# EAGLE design arduino mega cw keyer (EAGLE 7.6.0)
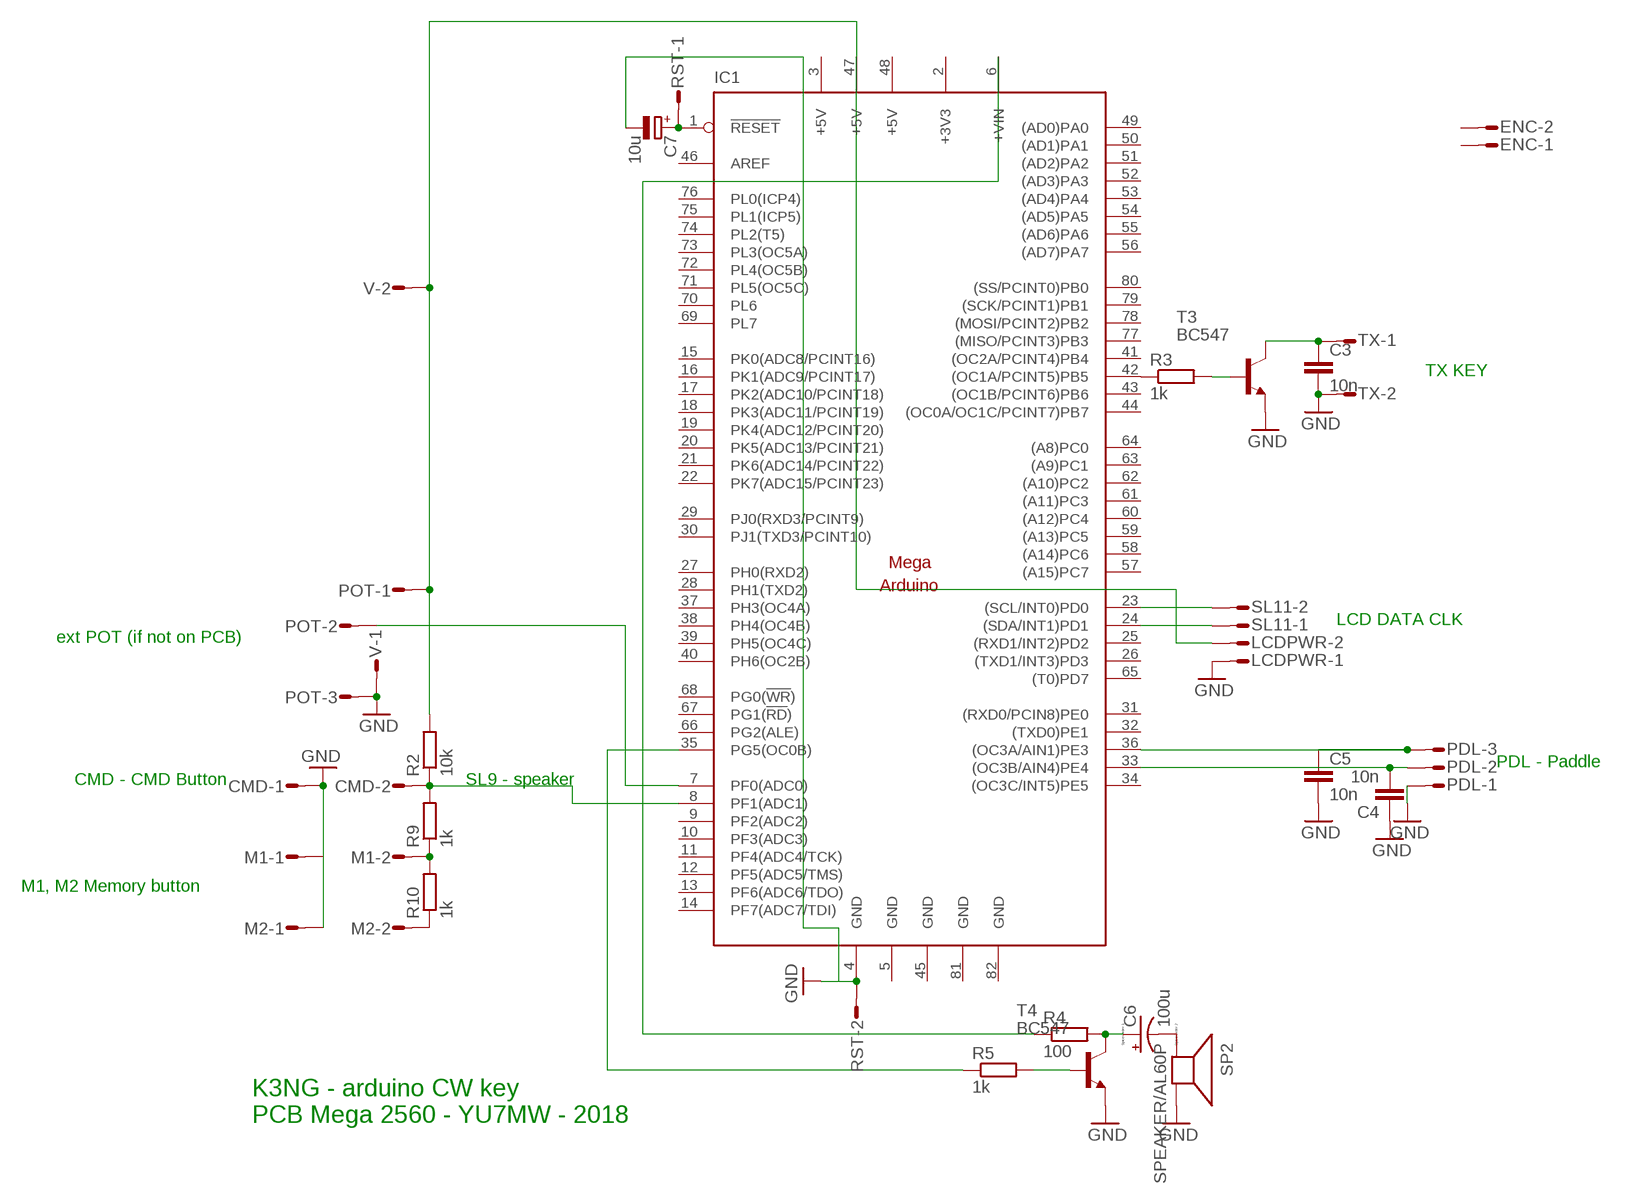
[diagram p0: schematic, sheet 1]

## Parts
C3  10n  C-EU050-025X075  [C050-025X075]
C4  10n  C-EU050-025X075  [C050-025X075]
C5  10n  C-EU050-025X075  [C050-025X075]
C6  100u  CPOL-USE2.5-5  [E2,5-5]
C7  10u  CPOL-EUE2,5-6E  [E2,5-6E]
CMD  M02S  [02P]
ENC  M02S  [02P]
IC1  MEGAARDUINO_1  [MEGA_ARDUINO]
LCDPWR  M02S  [02P]
M1  M02S  [02P]
M2  M02S  [02P]
PDL  M03S  [03P]
POT  M03S  [03P]
R2  10k  R-EU_0207/10  [0207/10]
R3  1k  R-EU_0207/10  [0207/10]
R4  100  R-EU_0207/10  [0207/10]
R5  1k  R-EU_0207/10  [0207/10]
R9  1k  R-EU_0207/10  [0207/10]
R10  1k  R-EU_0207/10  [0207/10]
RST  M02S  [02P]
SL11  M02S  [02P]
SP2  SPEAKER/AL60P  [AL60P]
T3  BC547  [TO92]
T4  BC547  [TO92]
TX  M02S  [02P]
V  M02S  [02P]

## Nets
GND: C3.2 C4.1 C5.2 C7.- CMD.1 IC1.4(GND) LCDPWR.1 M1.1 M2.1 PDL.1 POT.3 RST.2 SP2.2(-) T3.1(E) T4.1(E) TX.2 V.1
N$1: IC1.7(PF0(ADC0)) POT.2
N$4: IC1.23((SCL/INT0)PD0) SL11.2
N$5: IC1.24((SDA/INT1)PD1) SL11.1
N$6: IC1.42((OC1A/PCINT5)PB5) R3.1
N$7: C7.+ IC1.1(!RESET) RST.1
N$8: C5.1 IC1.36((OC3A/AIN1)PE3) PDL.3
N$9: C4.2 IC1.33((OC3B/AIN4)PE4) PDL.2
N$10: R3.2 T3.2(B)
N$11: C3.1 T3.3(C) TX.1
N$12: R5.2 T4.2(B)
N$13: C6.+ R4.2 T4.3(C)
N$15: C6.- SP2.1(+)
N$20: IC1.6(+VIN) R4.1
N$22: IC1.35(PG5(OC0B)) R5.1
N$23: CMD.2 IC1.8(PF1(ADC1)) R2.1 R9.2
N$25: M1.2 R9.1 R10.2
N$27: M2.2 R10.1
N$30: IC1.47(+5V) LCDPWR.2 POT.1 R2.2 V.2
Unconnected: ENC.1 ENC.2 IC1.9(PF2(ADC2)) IC1.10(PF3(ADC3)) IC1.11(PF4(ADC4/TCK)) IC1.12(PF5(ADC5/TMS)) IC1.13(PF6(ADC6/TDO)) IC1.14(PF7(ADC7/TDI)) IC1.15(PK0(ADC8/PCINT16)) IC1.16(PK1(ADC9/PCINT17)) IC1.17(PK2(ADC10/PCINT18)) IC1.18(PK3(ADC11/PCINT19)) IC1.19(PK4(ADC12/PCINT20)) IC1.20(PK5(ADC13/PCINT21)) IC1.21(PK6(ADC14/PCINT22)) IC1.22(PK7(ADC15/PCINT23)) IC1.25((RXD1/INT2)PD2) IC1.26((TXD1/INT3)PD3) IC1.27(PH0(RXD2)) IC1.28(PH1(TXD2)) IC1.29(PJ0(RXD3/PCINT9)) IC1.30(PJ1(TXD3/PCINT10)) IC1.31((RXD0/PCIN8)PE0) IC1.32((TXD0)PE1) IC1.34((OC3C/INT5)PE5) IC1.37(PH3(OC4A)) IC1.38(PH4(OC4B)) IC1.39(PH5(OC4C)) IC1.40(PH6(OC2B)) IC1.41((OC2A/PCINT4)PB4) IC1.43((OC1B/PCINT6)PB6) IC1.44((OC0A/OC1C/PCINT7)PB7) IC1.46(AREF) IC1.49((AD0)PA0) IC1.50((AD1)PA1) IC1.51((AD2)PA2) IC1.52((AD3)PA3) IC1.53((AD4)PA4) IC1.54((AD5)PA5) IC1.55((AD6)PA6) IC1.56((AD7)PA7) IC1.57((A15)PC7) IC1.58((A14)PC6) IC1.59((A13)PC5) IC1.60((A12)PC4) IC1.61((A11)PC3) IC1.62((A10)PC2) IC1.63((A9)PC1) IC1.64((A8)PC0) IC1.65((T0)PD7) IC1.66(PG2(ALE)) IC1.67(PG1(!RD!)) IC1.68(PG0(!WR!)) IC1.69(PL7) IC1.70(PL6) IC1.71(PL5(OC5C)) IC1.72(PL4(OC5B)) IC1.73(PL3(OC5A)) IC1.74(PL2(T5)) IC1.75(PL1(ICP5)) IC1.76(PL0(ICP4)) IC1.77((MISO/PCINT3)PB3) IC1.78((MOSI/PCINT2)PB2) IC1.79((SCK/PCINT1)PB1) IC1.80((SS/PCINT0)PB0)

## Notes on the sheet
- TX KEY
- LCD DATA CLK
- ext POT (if not on PCB)
- PDL - Paddle
- CMD - CMD Button | SL9 - speaker
- M1, M2 Memory button
- K3NG - arduino CW key
  PCB Mega 2560 - YU7MW - 2018

## Power pins joined to a net without a drawn wire
+3V3: IC1.2(+3V3)
+5V: IC1.3(+5V) IC1.48(+5V)
GND: IC1.5(GND) IC1.45(GND) IC1.81(GND) IC1.82(GND)

## Library data of the parts
C3-C5 = resistor:C-EU: CAPACITOR, European symbol
C6 = resistor:CPOL-US: POLARIZED CAPACITOR, American symbol
C7 = resistor:CPOL-EU: POLARIZED CAPACITOR, European symbol
CMD ENC LCDPWR M1 M2 RST SL11 TX V = con-amp-quick:M02S: AMP QUICK CONNECTOR; OC_FARNELL: unknown; OC_NEWARK: unknown
IC1 = arduino1:MEGAARDUINO_1: The Arduino Mega is a microcontroller board based on the ATmega1280. - 54 digital input/output pins (of which 14 can be used as PWM outputs) - 16 analog inputs - 4 UARTs (hardware serial ports) - 16 MHz crystal oscillator - USB connection - power jack - ICSP header - reset button It contains everything needed to support the microcontroller; simply connect it to a computer with a USB cable or power it with a AC-to-DC adapter or battery to get started. The Mega is compatible with most shields designed for the Arduino Duemilanove or Diecimila. http://arduino.cc/en/Main/ArduinoBoardMega
PDL POT = con-amp-quick:M03S: AMP QUICK CONNECTOR; OC_FARNELL: unknown; OC_NEWARK: unknown
R2-R5 R9 R10 = resistor:R-EU_: RESISTOR, European symbol
SP2 = adafruit:SPEAKER: SPEAKER Source: Buerklin Added PS12 (for part # PS1240 piezo) http://www.ladyada.net/library/pcb/eaglelibrary.html
T3 T4 = transistor:BC547: NPN TRANSISTOR

## Board
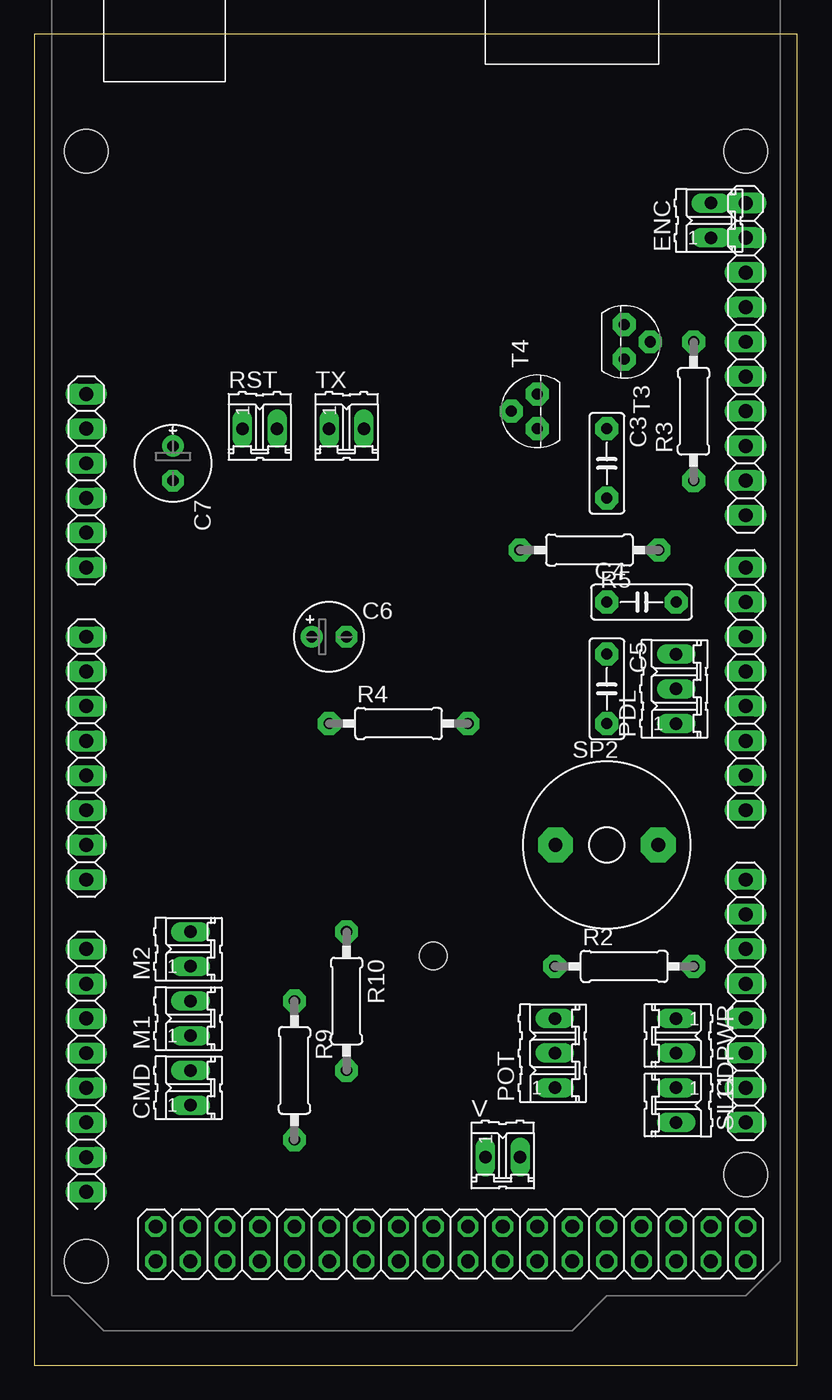
[diagram p1: board, top side]
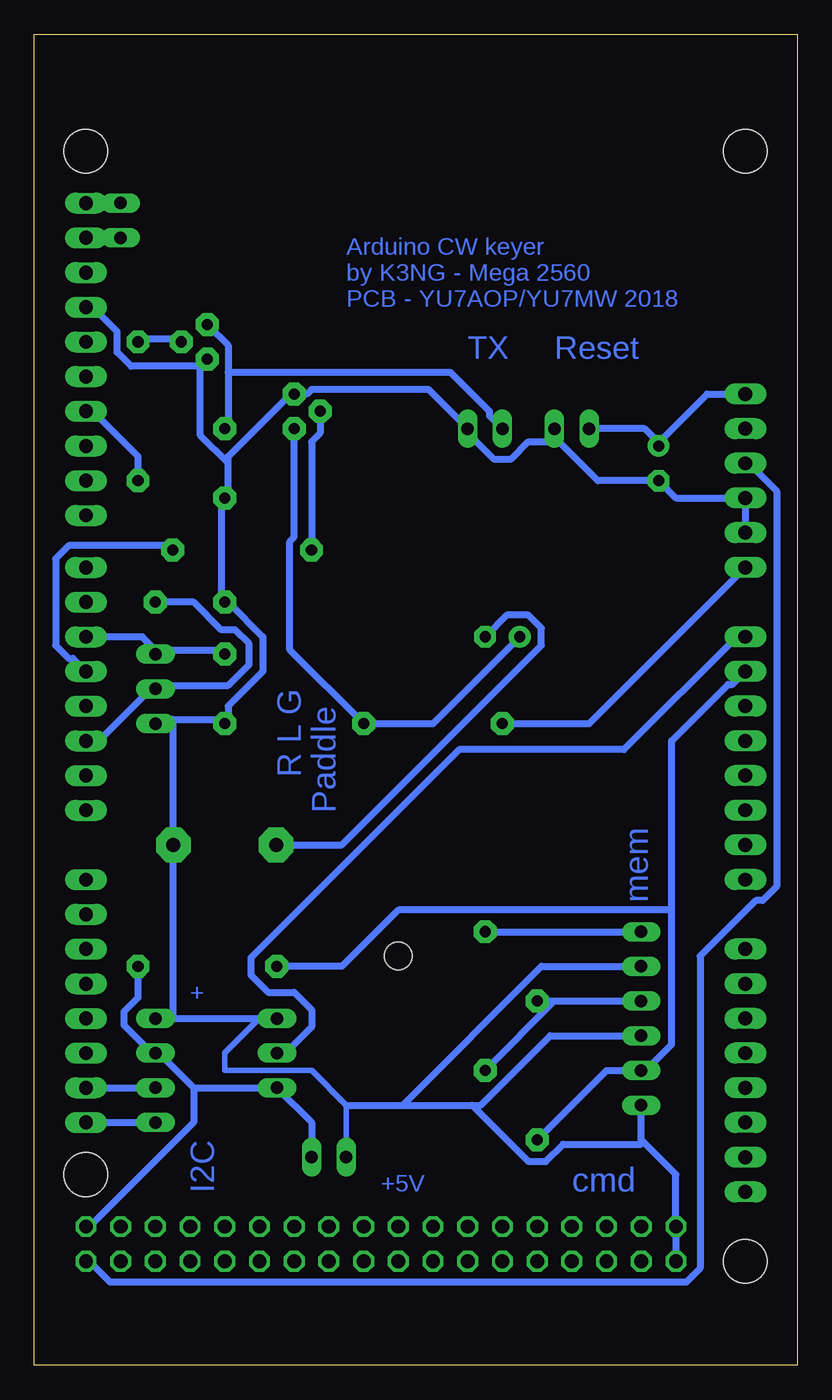
[diagram p2: board, bottom side, seen from below]

Size 55.86 x 97.46 mm. Coordinates in mm from the lower left corner, seen from the top.
Outline: 0,0 55.86,0 55.86,97.46 0,97.46 0,0
Copper layers (1*16): Top 0.035mm / dielectric 1.5mm / Bottom 0.035mm
Design rules "default *": minimum track width 20mil, minimum drill 24mil, track to track 20mil, track to pad 15mil, pad to pad 8mil, via to via 8mil, smd to smd 8mil, copper to edge 40mil, drill to drill 8mil, minimum pad ring 10mil, minimum via ring 8mil, stop-mask expansion 4mil, vias tented up to drill 0mil, thermal gap 10mil

### Footprints (pad centres in the part's own frame; a part is rotated, then mirrored left to right if it is on the bottom)
C050-025X075 = drill 0.813 pad 1.676 octagon: 1 -2.54,0; 2 2.54,0
E2,5-5 = drill 0.813 pad 1.6: + -1.27,0 | drill 0.813 pad 1.6 octagon: - 1.27,0
E2,5-6E = drill 0.813 pad 1.575: + -1.27,0 | drill 0.813 pad 1.575 octagon: - 1.27,0
02P = drill 0.914 long: 1 -1.27,0; 2 1.27,0
MEGA_ARDUINO = drill 1.016 long: 1 33.02,2.54; 2 35.56,2.54; 3 38.1,2.54; 4 40.64,2.54; 5 43.18,2.54; 6 45.72,2.54; 7 50.8,2.54; 8 53.34,2.54; 9 55.88,2.54; 10 58.42,2.54; 11 60.96,2.54; 12 63.5,2.54; 13 66.04,2.54; 14 68.58,2.54; 15 73.66,2.54; 16 76.2,2.54; 17 78.74,2.54; 18 81.28,2.54; 19 83.82,2.54; 20 86.36,2.54; 21 88.9,2.54; 22 91.44,2.54; 23 86.36,50.8; 24 83.82,50.8; 25 81.28,50.8; 26 78.74,50.8; 27 76.2,50.8; 28 73.66,50.8; 29 71.12,50.8; 30 68.58,50.8; 31 63.5,50.8; 32 60.96,50.8; 33 58.42,50.8; 34 55.88,50.8; 35 53.34,50.8; 36 50.8,50.8; 37 48.26,50.8; 38 45.72,50.8; 39 41.91,50.8; 40 39.37,50.8; 41 36.83,50.8; 42 34.29,50.8; 43 31.75,50.8; 44 29.21,50.8; 45 26.67,50.8; 46 24.13,50.8; 83 21.59,50.8; 84 19.05,50.8 | drill 1.016 octagon: 47 93.98,50.8; 48 96.52,50.8; 49 93.98,48.26; 50 96.52,48.26; 51 93.98,45.72; 52 96.52,45.72; 53 93.98,43.18; 54 96.52,43.18; 55 93.98,40.64; 56 96.52,40.64; 57 93.98,38.1; 58 96.52,38.1; 59 93.98,35.56; 60 96.52,35.56; 61 93.98,33.02; 62 96.52,33.02; 63 93.98,30.48; 64 96.52,30.48; 65 93.98,27.94; 66 96.52,27.94; 67 93.98,25.4; 68 96.52,25.4; 69 93.98,22.86; 70 96.52,22.86; 71 93.98,20.32; 72 96.52,20.32; 73 93.98,17.78; 74 96.52,17.78; 75 93.98,15.24; 76 96.52,15.24; 77 93.98,12.7; 78 96.52,12.7; 79 93.98,10.16; 80 96.52,10.16; 81 93.98,7.62; 82 96.52,7.62 | hole 3.2: 15.24,50.8; 15.24,2.54; 90.17,50.8; 96.52,2.54 | hole 2: 74.168,27.94
03P = drill 0.914 long: 1 -2.54,0; 2 0,0; 3 2.54,0
0207/10 = drill 0.813 pad 1.676 octagon: 1 -5.08,0; 2 5.08,0
AL60P = drill 1.016 pad 2.54 octagon: 1 -3.759,0; 2 3.759,0
TO92 = drill 0.813 pad 1.676 octagon: 1 1.27,0; 2 0,1.905; 3 -1.27,0

### Placement (x,y rotation side)
C3  41.91,66.04 270 top
C4  44.45,55.88 0 top
C5  41.91,49.53 270 top
C6  21.59,53.34 0 top
C7  10.16,66.04 270 top
CMD  11.43,20.32 90 top
ENC  49.53,83.82 90 top
IC1  1.27,104.14 270 top
LCDPWR  46.99,24.13 270 top
M1  11.43,25.4 90 top
M2  11.43,30.48 90 top
PDL  46.99,49.53 90 top
POT  38.1,22.86 90 top
R2  43.18,29.21 0 top
R3  48.26,69.85 90 top
R4  26.67,46.99 0 top
R5  40.64,59.69 180 top
R9  19.05,21.59 270 top
R10  22.86,26.67 270 top
RST  16.51,68.58 0 top
SL11  46.99,19.05 270 top
SP2  41.91,38.1 0 top
T3  43.18,74.93 270 top
T4  36.83,69.85 90 top
TX  22.86,68.58 0 top
V  34.29,15.24 0 top

### Tracks (layer width: path | path; a pad name or v marks a point on that pad's centre or on a via)
+5V
  Bottom 0.508: IC1.48 51.82,7.62 50.29,6.1 8.13,6.1 7.11,7.11 7.11,29.97 3.05,34.04 2.54,34.04 1.52,35.05 1.52,64.01 3.56,66.04 IC1.3
GND
  Bottom 0.406: POT.3 39.37,25.4 41.91,22.86 41.91,21.59 35.56,21.59 33.02,19.05 V.1
  Bottom 0.508: 43.69,73.15 48.77,73.15 49.78,74.17 49.78,75.69 51.31,77.22 51.82,77.22 IC1.45 | 41.66,66.04 41.66,63.5 C3.2 42.16,63.5 42.16,55.88 C4.1 41.66,55.88 39.12,53.34 39.12,50.8 41.66,48.26 41.66,47.24 C5.2 42.16,47.24 46.74,47.24 PDL.1 45.72,47.31 45.72,38.1 | 41.66,66.04 41.66,66.55 37.08,71.12 T4.1 35.88,71.12 35.56,71.44 26.99,71.44 TX.2 24.45,68.58 22.23,66.36 20.95,66.36 19.68,67.63 17.78,67.63 RST.2 17.78,67.94 14.61,64.77 C7.- 8.89,63.5 IC1.4 IC1.5 | 43.69,73.15 43.69,68.07 41.66,66.04 | 43.69,73.15 T3.1 | IC1.82 IC1.81 8.89,13.97 11.27,16.35 | LCDPWR.1 45.72,25.4 | 45.72,25.4 POT.3 | 45.72,38.1 45.72,25.4 | 45.72,38.1 SP2.2 | CMD.1 11.43,16.51 11.27,16.35 | M1.1 18.1,24.13 23.18,19.05 23.81,19.05 | 33.02,19.05 28.89,19.05 | 28.89,19.05 23.81,19.05 | M2.1 18.73,29.21 28.89,19.05 | 23.81,19.05 19.68,14.92 18.41,14.92 17.14,16.19 11.43,16.19 11.27,16.35
N$1
  Bottom 0.508: POT.2 37.47,22.86 35.56,24.77 35.56,26.04 36.83,27.3 38.73,27.3 40.01,28.58 40.01,29.84 24.77,45.09 12.7,45.09 4.45,53.34 IC1.7
N$4
  Bottom 0.508: IC1.23 SL11.2
N$5
  Bottom 0.508: IC1.24 SL11.1
N$6
  Bottom 0.508: R3.1 48.26,66.55 51.31,69.6 51.82,69.6 IC1.42
N$7
  Bottom 0.508: RST.1 11.18,68.58 10.16,67.56 | IC1.1 6.6,71.12 10.16,67.56 | 10.16,67.56 C7.+
N$8
  Bottom 0.508: C5.1 42.16,52.32 46.74,52.32 PDL.3 46.99,52.39 47.94,53.34 IC1.36
N$9
  Bottom 0.508: C4.2 44.2,55.88 42.16,53.85 41.15,53.85 40.13,52.83 40.13,51.31 41.66,49.78 46.74,49.78 PDL.2 46.99,49.85 51.12,45.72 IC1.33
N$10
  Bottom 0.508: T3.2 45.21,75.18 48.26,75.18 R3.2
N$11
  Bottom 0.508: 41.66,72.71 41.66,74.68 T3.3 | 41.66,72.71 41.66,68.58 C3.1 | TX.1 22.54,69.53 22.54,69.85 25.4,72.71 41.66,72.71
N$12
  Bottom 0.508: R5.2 35.56,67.63 34.92,68.26 T4.2
N$13
  Bottom 0.508: C6.+ 26.67,46.99 R4.2 37.15,52.39 37.15,60.33 36.83,60.64 T4.3
N$15
  Bottom 0.508: C6.- 21.27,54.93 19.68,54.93 18.73,53.98 18.73,52.7 33.34,38.1 SP2.1
N$20
  Bottom 0.508: IC1.6 15.24,46.99 R4.1
N$22
  Bottom 0.508: IC1.35 53.02,51.75 53.34,51.75 54.29,52.7 54.29,59.05 53.34,60.01 46.04,60.01 R5.1
N$23
  Bottom 0.508: R9.2 13.97,21.59 CMD.2 11.11,21.59 9.21,23.5 9.21,33.34 | IC1.8 4.76,49.85 5.08,49.85 9.21,45.72 9.21,33.34 | R2.1 33.34,29.21 29.21,33.34 9.21,33.34
N$25
  Bottom 0.508: R9.1 17.78,26.67 | 17.78,26.67 M1.2 | 17.78,26.67 R10.2
N$27
  Bottom 0.508: R10.1 M2.2
N$30
  Bottom 0.508: 44.2,20.32 POT.1 35.56,17.78 V.2 | 44.2,20.32 46.74,22.86 LCDPWR.2 47.24,22.86 49.28,24.89 49.28,25.91 48.26,26.92 R2.2 | 44.2,20.32 44.2,17.78 51.82,10.16 IC1.47

### Text on the board
Bottom: Arduino CW keyer / by K3NG - Mega 2560 / PCB - YU7AOP/YU7MW 2018 | Reset | TX | R L G | Paddle | mem | + | I2C | cmd | +5V